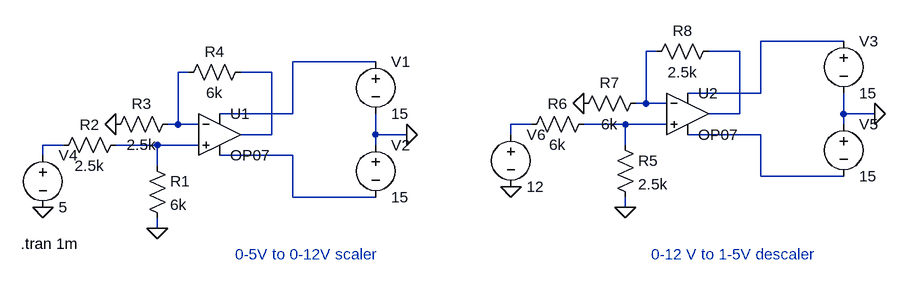
[diagram p0: schematic Scaler_Descaler.asc]
Scaler_Descaler.asc, the LTspice schematic file:
Version 4
SHEET 1 1220 680
WIRE 1152 0 1024 0
WIRE 864 16 848 16
WIRE 992 16 944 16
WIRE 432 32 304 32
WIRE 144 48 128 48
WIRE 272 48 224 48
WIRE 1024 80 1024 0
WIRE 1024 80 912 80
WIRE 848 96 848 16
WIRE 848 96 832 96
WIRE 880 96 848 96
WIRE 304 112 304 32
WIRE 304 112 192 112
WIRE 992 112 992 16
WIRE 992 112 944 112
WIRE 1152 112 1152 80
WIRE 1200 112 1152 112
WIRE 128 128 128 48
WIRE 128 128 112 128
WIRE 160 128 128 128
WIRE 672 128 640 128
WIRE 816 128 752 128
WIRE 880 128 816 128
WIRE 1152 128 1152 112
WIRE 272 144 272 48
WIRE 272 144 224 144
WIRE 432 144 432 112
WIRE 480 144 432 144
WIRE 640 144 640 128
WIRE 1024 144 912 144
WIRE -48 160 -80 160
WIRE 96 160 32 160
WIRE 160 160 96 160
WIRE 432 160 432 144
WIRE 816 160 816 128
WIRE -80 176 -80 160
WIRE 304 176 192 176
WIRE 96 192 96 160
WIRE 1024 208 1024 144
WIRE 1152 208 1024 208
WIRE 304 240 304 176
WIRE 432 240 304 240
WIRE 816 256 816 240
WIRE 96 288 96 272
FLAG 480 144 0
FLAG 96 288 0
FLAG -80 256 0
FLAG 32 128 0
FLAG 1200 112 0
FLAG 816 256 0
FLAG 640 224 0
FLAG 752 96 0
SYMBOL OpAmps\\OP07 192 80 R0
SYMATTR InstName U1
SYMBOL voltage 432 16 R0
WINDOW 123 0 0 Left 0
WINDOW 39 0 0 Left 0
SYMATTR InstName V1
SYMATTR Value 15
SYMBOL voltage 432 144 R0
WINDOW 123 0 0 Left 0
WINDOW 39 0 0 Left 0
SYMATTR InstName V2
SYMATTR Value 15
SYMBOL res 80 176 R0
SYMATTR InstName R1
SYMATTR Value 6k
SYMBOL res 48 144 R90
WINDOW 0 0 56 VBottom 2
WINDOW 3 32 56 VTop 2
SYMATTR InstName R2
SYMATTR Value 2.5k
SYMBOL res 128 112 R90
WINDOW 0 0 56 VBottom 2
WINDOW 3 32 56 VTop 2
SYMATTR InstName R3
SYMATTR Value 2.5k
SYMBOL res 240 32 R90
WINDOW 0 0 56 VBottom 2
WINDOW 3 32 56 VTop 2
SYMATTR InstName R4
SYMATTR Value 6k
SYMBOL voltage -80 160 R0
WINDOW 123 0 0 Left 0
WINDOW 39 0 0 Left 0
SYMATTR InstName V4
SYMATTR Value 5
SYMBOL OpAmps\\OP07 912 48 R0
SYMATTR InstName U2
SYMBOL voltage 1152 -16 R0
WINDOW 123 0 0 Left 0
WINDOW 39 0 0 Left 0
SYMATTR InstName V3
SYMATTR Value 15
SYMBOL voltage 1152 112 R0
WINDOW 123 0 0 Left 0
WINDOW 39 0 0 Left 0
SYMATTR InstName V5
SYMATTR Value 15
SYMBOL res 800 144 R0
SYMATTR InstName R5
SYMATTR Value 2.5k
SYMBOL res 768 112 R90
WINDOW 0 0 56 VBottom 2
WINDOW 3 32 56 VTop 2
SYMATTR InstName R6
SYMATTR Value 6k
SYMBOL res 848 80 R90
WINDOW 0 0 56 VBottom 2
WINDOW 3 32 56 VTop 2
SYMATTR InstName R7
SYMATTR Value 6k
SYMBOL res 960 0 R90
WINDOW 0 0 56 VBottom 2
WINDOW 3 32 56 VTop 2
SYMATTR InstName R8
SYMATTR Value 2.5k
SYMBOL voltage 640 128 R0
WINDOW 123 0 0 Left 0
WINDOW 39 0 0 Left 0
SYMATTR InstName V6
SYMATTR Value 12
TEXT -114 312 Left 2 !.tran 1m
TEXT 216 328 Left 2 ;0-5V to 0-12V scaler
TEXT 856 328 Left 2 ;0-12 V to 1-5V descaler

The netlist it stands for:
* Scaler_Descaler.asc
XU1 N011 N005 N004 N012 N006 LT1001  ; OP07, pins In+ In- V+ V- OUT
V1 N004 0 15
V2 0 N012 15
R1 N011 0 6k
R2 N011 N010 2.5k
R3 N005 0 2.5k
R4 N006 N005 6k
V4 N010 0 5
XU2 N008 N002 N001 N009 N003 LT1001  ; OP07, pins In+ In- V+ V- OUT
V3 N001 0 15
V5 0 N009 15
R5 N008 0 2.5k
R6 N008 N007 6k
R7 N002 0 6k
R8 N003 N002 2.5k
V6 N007 0 12
.tran 1m
* 0-5V to 0-12V scaler
* 0-12 V to 1-5V descaler
.lib LTC.lib
.backanno
.end